# EAGLE design Drehzahlregler-Einfach (EAGLE 6.2)
PWM Motordrehzahlregler mit TCL555 und MosFET
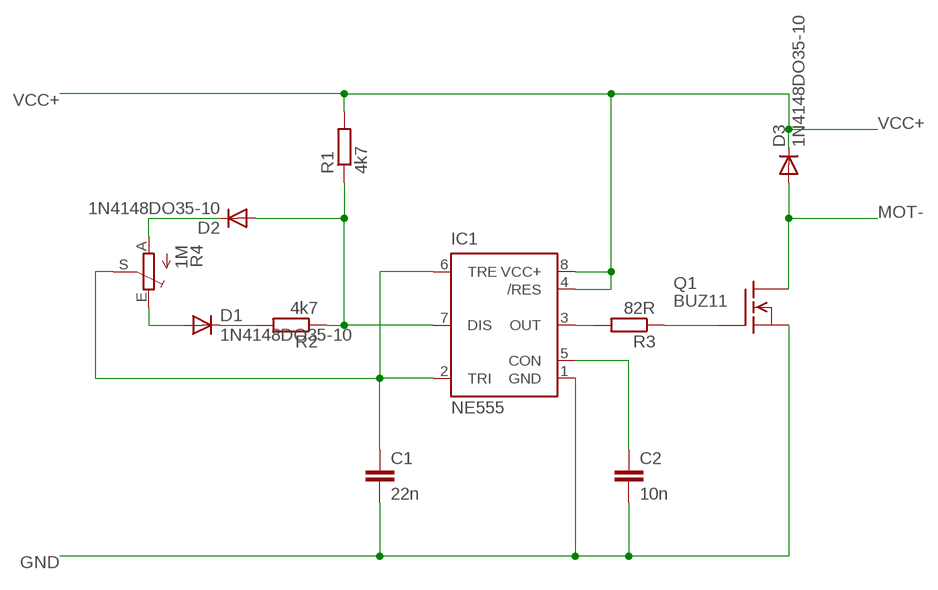
[diagram p0: schematic, sheet 1]

## Parts
C1  22n  C5/2.5  [C5B2.5]
C2  10n  C5/2.5  [C5B2.5]
D1  1N4148DO35-10  [DO35-10]
D2  1N4148DO35-10  [DO35-10]
D3  1N4148DO35-10  [DO35-10]
IC1  NE555  [DIL-08]
Q1  BUZ11  [TO220]
R1  4k7  R-EU_0207/10  [0207/10]
R2  4k7  R-EU_0207/10  [0207/10]
R3  82R  R-EU_0207/10  [0207/10]
R4  1M  TRIM_EU-CIP20C-4MM  [CIP20C-4MM]

## Nets
GND: C1.2 C2.2 IC1.1(GND) Q1.3(S)
MOT-: D3.A Q1.2(D)
N$1: D2.A IC1.7(DIS) R1.1 R2.1
N$2: D2.C R4.A
N$3: D1.A R4.E
N$4: D1.C R2.2
N$6: C1.1 IC1.2(TRI) IC1.6(TRE) R4.S
N$7: C2.1 IC1.5(CON)
N$8: IC1.3(OUT) R3.2
N$9: Q1.1(G) R3.1
VCC+: D3.C IC1.4(/RES) IC1.8(VCC+) R1.2

## Library data of the parts
C1 C2 = capacitor-wima:C: CAPACITOR naming: grid - package width
D1-D3 = diode:1N4148: DIODE high speed (Philips)
IC1 = st-microelectronics:NE555: General purpose bipolar Timer; MF: Arrow Electronics; MPN: NE555N; OC_FARNELL: 1467742; OC_NEWARK: 89K1486
Q1 = transistor-fet:BUZ11: N-Channel Enhancement MOSFET 50V; 30A; 0,040Ohm
R1-R3 = resistor:R-EU_: RESISTOR, European symbol
R4 = pot:TRIM_EU-: POTENTIOMETER

## Board
PWM Motordrehzahlregler
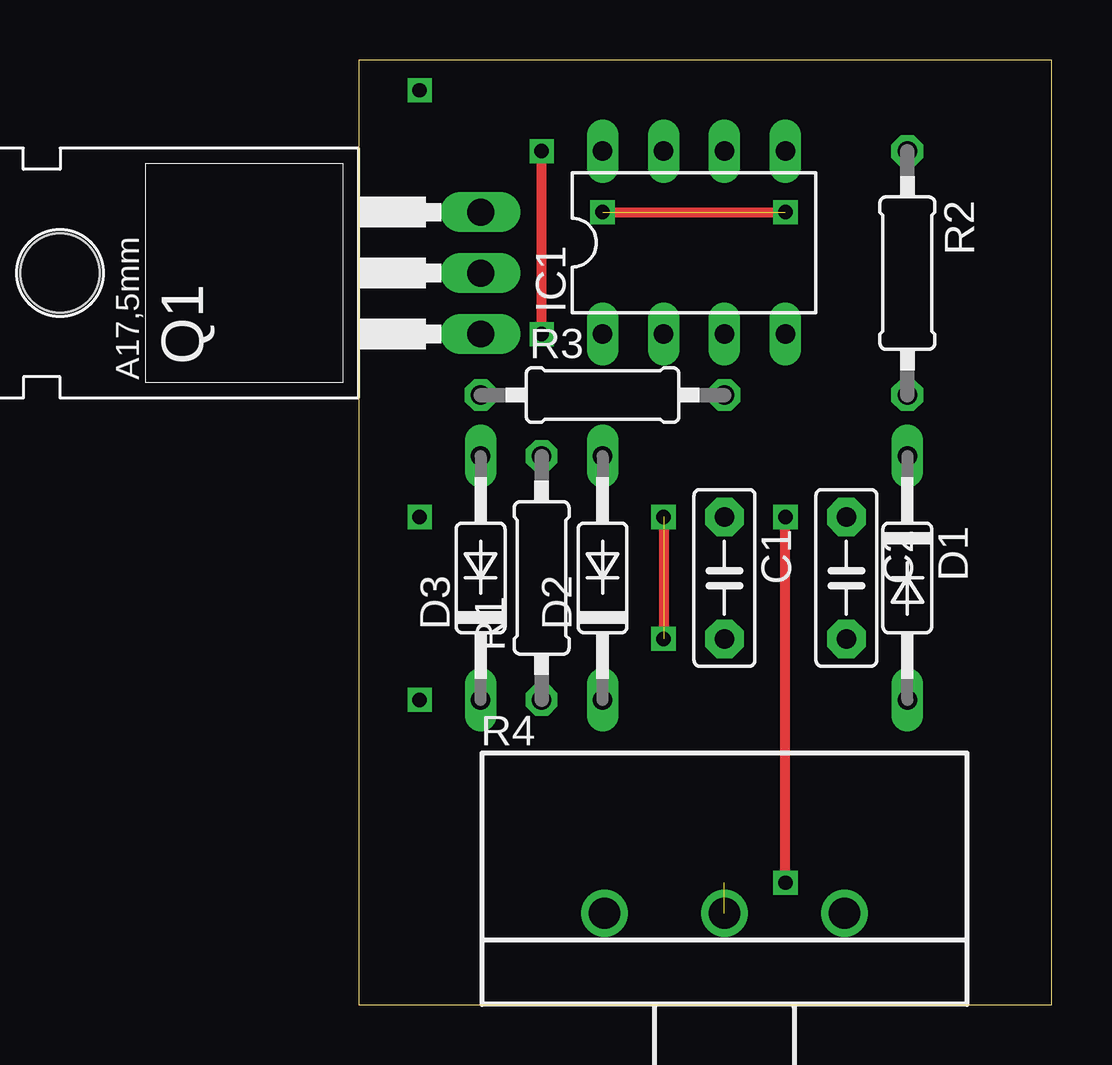
[diagram p1: board, top side]
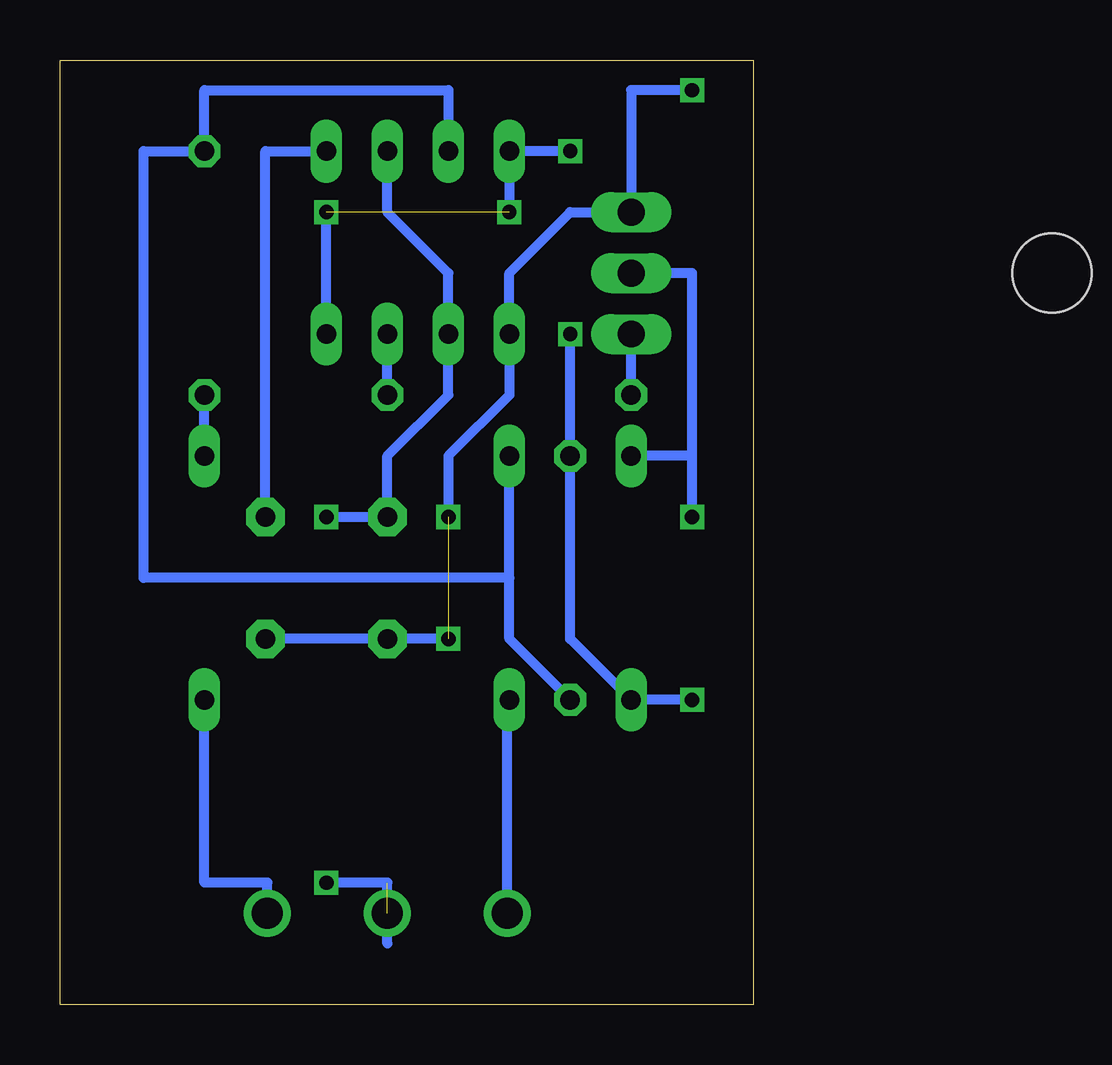
[diagram p2: board, bottom side, seen from below]

Size 28.88 x 39.36 mm. Coordinates in mm from the lower left corner, seen from the top.
Outline: 0,0 28.88,0 28.88,39.36 0,39.36 0,0
Copper layers (1*16): Top 0.035mm / dielectric 1.5mm / Bottom 0.035mm
Design rules: minimum track width 10mil, minimum drill 24mil, track to track 8mil, track to pad 8mil, pad to pad 8mil, via to via 8mil, smd to smd 8mil, copper to edge 40mil, drill to drill 8mil, minimum pad ring 10mil, minimum via ring 8mil, stop-mask expansion 4mil, vias tented up to drill 0mil, thermal gap 10mil

### Footprints (pad centres in the part's own frame; a part is rotated, then mirrored left to right if it is on the bottom)
C5B2.5 = drill 0.813 pad 1.6 octagon: 1 -2.54,0; 2 2.54,0
DO35-10 = drill 0.813 long: A 5.08,0; C -5.08,0
DIL-08 = drill 0.813 long: 1 -3.81,-3.81; 2 -1.27,-3.81; 3 1.27,-3.81; 4 3.81,-3.81; 5 3.81,3.81; 6 1.27,3.81; 7 -1.27,3.81; 8 -3.81,3.81
TO220 = drill 1.118 long: 1 -2.54,-6.35; 2 0,-6.35; 3 2.54,-6.35 | hole 3.302: 0,11.176
0207/10 = drill 0.813 octagon: 1 -5.08,0; 2 5.08,0
CIP20C-4MM = drill 1.3 pad 1.93: A -5,0; E 5,0; S 0,0

### Placement (x,y rotation side)
C1  15.24,17.78 270 top
C2  20.32,17.78 270 top
D1  22.86,17.78 270 top
D2  10.16,17.78 90 top
D3  5.08,17.78 90 top
IC1  13.97,31.75 0 top
Q1  -1.27,30.48 90 top
R1  7.62,17.78 90 top
R2  22.86,30.48 270 top
R3  10.16,25.4 0 top
R4  15.24,3.81 0 top

### Tracks (layer width: path | path; a pad name or v marks a point on that pad's centre or on a via)
GND  (via drill 0.6)  (1 unrouted)
  Bottom 0.406: C2.2 C1.2 12.7,15.24 | 12.7,20.32 12.7,22.86 10.16,25.4 IC1.1 10.16,30.48 7.62,33.02 Q1.3 5.08,38.1 v2.54,38.1
MOT-  (via drill 0.6)
  Bottom 0.406: 2.54,22.86 D3.A | 2.54,22.86 2.54,30.48 Q1.2 | v2.54,20.32 2.54,22.86
N$1
  Bottom 0.406: IC1.7 12.7,38.1 22.86,38.1 R2.1 25.4,35.56 25.4,17.78 10.16,17.78 | R1.1 10.16,15.24 10.16,17.78 | 10.16,17.78 D2.A
N$2
  Bottom 0.406: D2.C 10.24,12.7 R4.A
N$3
  Bottom 0.406: D1.A 22.86,5.08 20.24,5.08 R4.E
N$4
  Bottom 0.406: D1.C R2.2
N$6  (via drill 0.6)  (1 unrouted)
  Top 0.406: v17.78,5.08 v17.78,20.32
  Bottom 0.406: IC1.6 15.24,33.02 12.7,30.48 IC1.2 12.7,25.4 15.24,22.86 C1.1 v17.78,20.32 | 15.24,2.54 15.24,5.08 v17.78,5.08
N$7
  Bottom 0.406: IC1.5 20.32,35.56 C2.1
N$8
  Bottom 0.406: R3.2 IC1.3
N$9
  Bottom 0.406: R3.1 Q1.1
N$10  (via drill 0.6)
  Top 0.406: v10.16,33.02 v17.78,33.02
N$20  (via drill 0.6)
  Top 0.406: v12.7,20.32 v12.7,15.24
VCC+  (via drill 0.6)  (1 unrouted)
  Top 0.406: v7.62,27.94 v7.62,35.56
  Bottom 0.406: 10.16,33.02 IC1.8 v7.62,35.56 | IC1.4 17.78,33.02 | v7.62,27.94 R1.2 7.62,15.24 D3.C v2.54,12.7